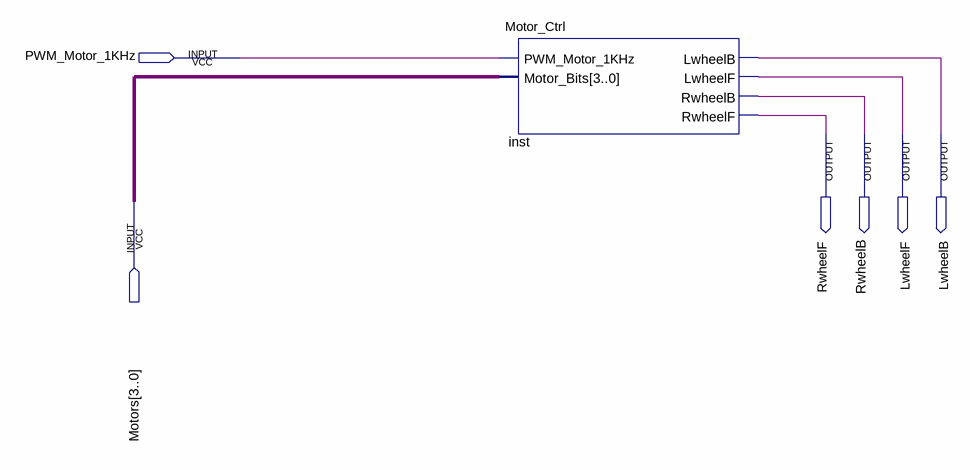
[diagram p0: schematic sheet]
// Quartus schematic PWM_ctrl_example.bdf as structural Verilog: 1 symbols, 6 pins
module PWM_ctrl_example (
  input  PWM_Motor_1KHz,
  input  [3:0] Motors,
  output RwheelF,
  output RwheelB,
  output LwheelF,
  output LwheelB
);

  Motor_Ctrl inst (
    .PWM_Motor_1KHz(PWM_Motor_1KHz), .Motor_Bits(Motors), .LwheelB(LwheelB), .LwheelF(LwheelF),
    .RwheelB(RwheelB), .RwheelF(RwheelF));
endmodule
